# EAGLE design encoder_adapter (EAGLE 9.6.2)
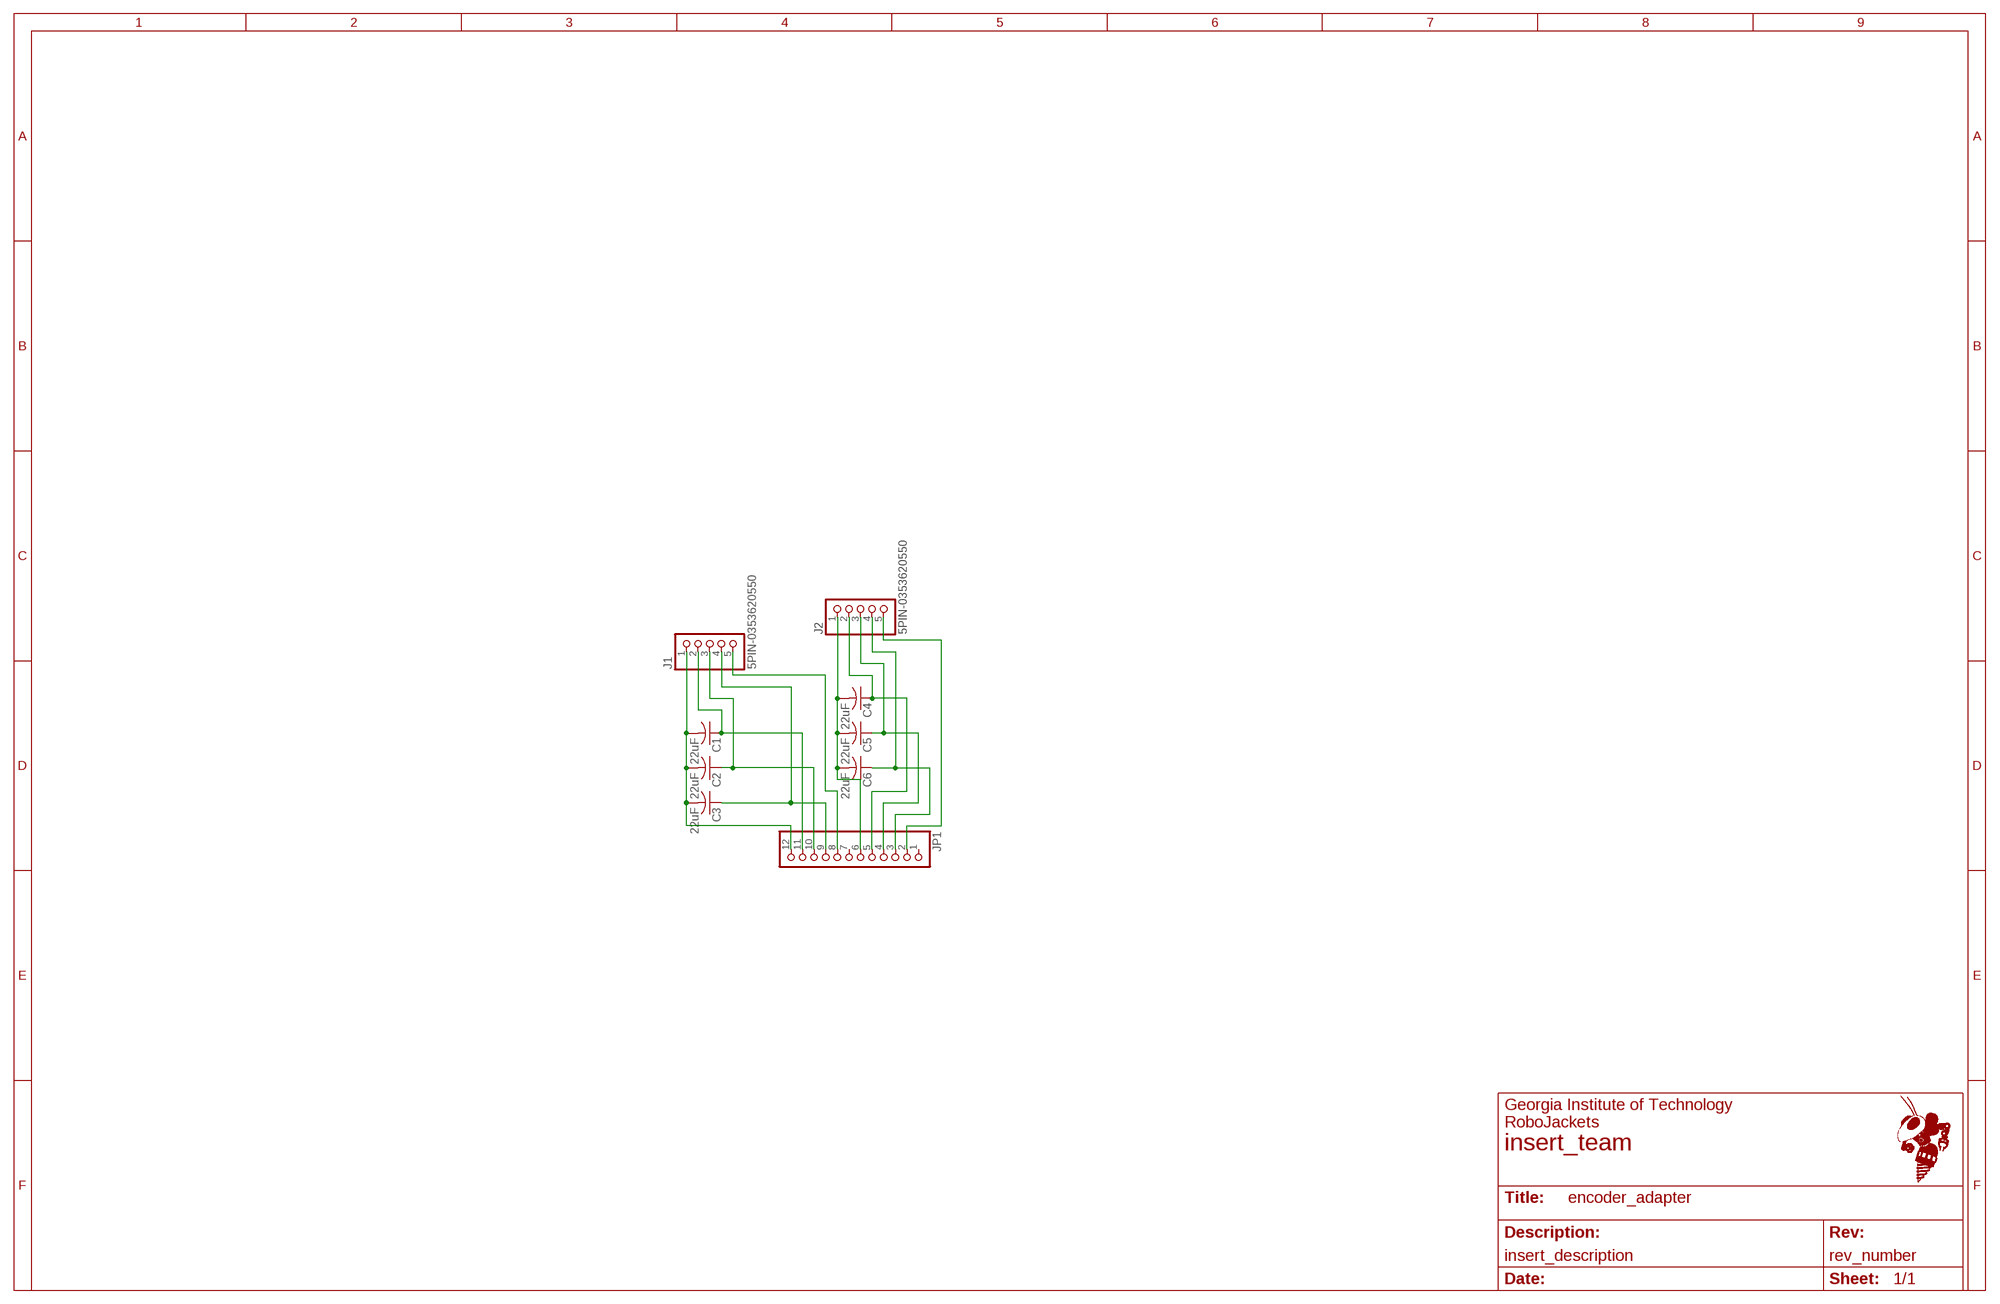
[diagram p0: schematic, sheet 1]
FRAME1 (FRAME_11_17): REVISION: rev_number; SCH_DESC: insert_description; TEAM: insert_team

## Parts
C1  22uF  C-USC0805  [C0805]
C2  22uF  C-USC0805  [C0805]
C3  22uF  C-USC0805  [C0805]
C4  22uF  C-USC0805  [C0805]
C5  22uF  C-USC0805  [C0805]
C6  22uF  C-USC0805  [C0805]
J1  5PIN-0353620550  [0353620550]
J2  5PIN-0353620550  [0353620550]
JP1  PINHD-1X12  [1X12]

## Nets
N$1: C1.2 C2.2 C3.2 J1.1 JP1.12
N$2: C3.1 J1.4 JP1.9
N$3: C1.1 J1.2 JP1.11
N$5: C2.1 J1.3 JP1.10
N$7: C4.1 J2.2 JP1.5
N$8: C5.1 J2.3 JP1.4
N$9: C6.1 J2.4 JP1.3
N$10: J2.5 JP1.2
N$11: J1.5 JP1.8
N$16: C4.2 C5.2 C6.2 J2.1 JP1.6
Unconnected: JP1.1 JP1.7

## Library data of the parts
C1-C6 = rcl:C-US: CAPACITOR, American symbol; SPICEPREFIX: C
J1 J2 = RoboJackets-Connectors:5PIN-03536?: Description: Connector Header Through Hole, 5 position 0.079" (2.00mm) Link H: Digi-Key <https://www.digikey.com/products/en?keywords=0353630560> Link V: Digi-Key <https://www.digikey.com/products/en?keywords=0353620550>; DKPN: WM18923-ND
JP1 = RoboJackets-Connectors:PINHD-1X12: PIN HEADER

## Board
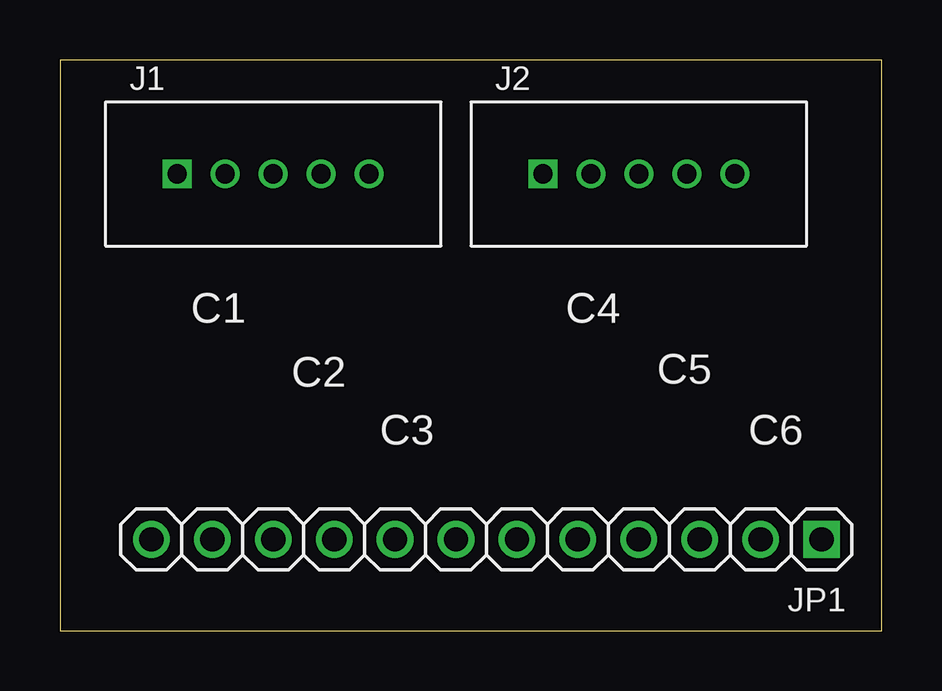
[diagram p1: board, top side]
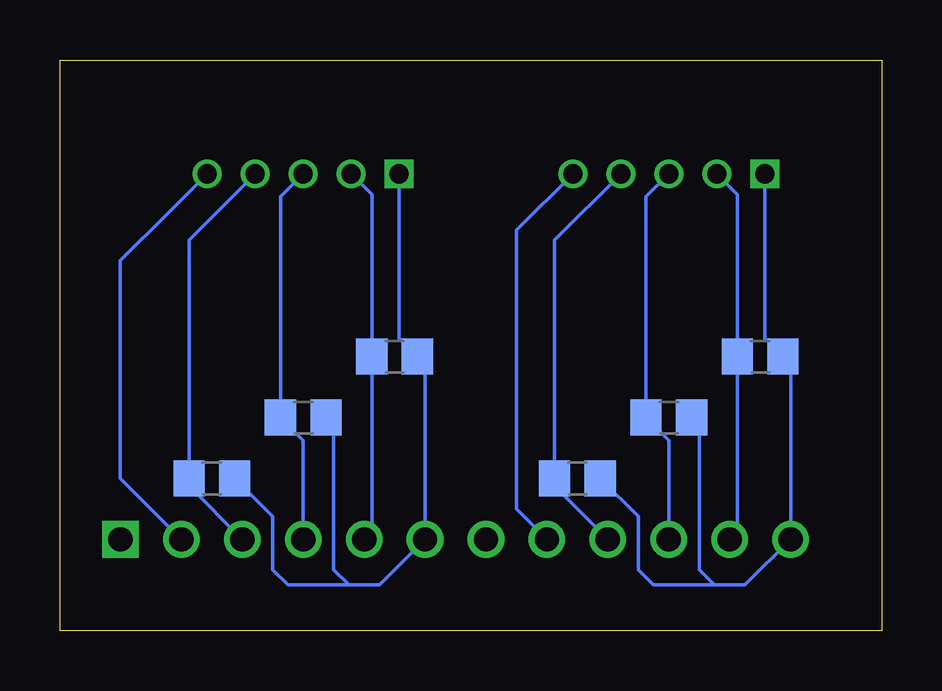
[diagram p2: board, bottom side, seen from below]

Size 34.27 x 23.8 mm. Coordinates in mm from the lower left corner, seen from the top.
Outline: 0,0 34.27,0 34.27,23.8 0,23.8 0,0
Copper layers 16: Bottom 0.035mm
Design rules "JLCPCB (1 Layer)": minimum track width 5mil, minimum drill 0.3mm, track to track 5mil, track to pad 5mil, pad to pad 5mil, via to via 20mil, smd to smd 5mil, copper to edge 0.2mm, drill to drill 21mil, minimum pad ring 6mil, minimum via ring 6mil, stop-mask expansion 2mil, vias tented up to drill 30mil, thermal gap 10mil

### Footprints (pad centres in the part's own frame; a part is rotated, then mirrored left to right if it is on the bottom)
C0805 = smd 1.3 x 1.5: 1 -0.95,0; 2 0.95,0
0353620550 = drill 0.8 square: 1 -4,0 | drill 0.8: 2 -2,0; 3 0,0; 4 2,0; 5 4,0
1X12 = drill 1.016 square: 1 -13.97,0 | drill 1.016: 2 -11.43,0; 3 -8.89,0; 4 -6.35,0; 5 -3.81,0; 6 -1.27,0; 7 1.27,0; 8 3.81,0; 9 6.35,0; 10 8.89,0; 11 11.43,0; 12 13.97,0

### Placement (x,y rotation side)
C1  5.08,11.43 0 bottom
C2  8.89,8.89 0 bottom
C3  12.7,6.35 0 bottom
C4  20.32,11.43 0 bottom
C5  24.13,8.89 0 bottom
C6  27.94,6.35 0 bottom
J1  8.89,19.05 0 top
J2  24.13,19.05 0 top
JP1  17.78,3.81 180 top

### Tracks (layer width: path | path; a pad name or v marks a point on that pad's centre or on a via)
N$1
  Bottom 0.152: J1.1 4.89,12.19 C1.2 3.81,11.11 JP1.12 5.71,1.91 6.98,1.91 | C3.2 10.16,4.76 10.16,2.54 9.53,1.91 6.98,1.91 | C2.2 7.62,8.57 7.62,2.54 6.98,1.91
N$2
  Bottom 0.152: JP1.9 13.65,6.03 C3.1 13.65,16.29 J1.4
N$3
  Bottom 0.152: J1.2 6.03,18.19 C1.1 6.03,4.13 JP1.11
N$5
  Bottom 0.152: 9.84,8.67 C2.1 | JP1.10 8.89,7.94 C2.1 | C2.1 9.84,18.1 J1.3
N$7
  Bottom 0.152: JP1.5 21.27,4.13 C4.1 21.27,18.19 J2.2
N$8
  Bottom 0.152: JP1.4 24.13,7.94 C5.1 25.08,18.1 J2.3
N$9
  Bottom 0.152: JP1.3 28.89,6.03 C6.1 28.89,16.29 J2.4
N$10
  Bottom 0.152: J2.5 29.31,17.88 29.74,17.44 31.75,15.43 31.75,6.35 JP1.2
N$11
  Bottom 0.152: JP1.8 15.24,5.08 15.24,16.7 J1.5
N$16
  Bottom 0.152: J2.1 20.13,12.19 C4.2 19.05,11.11 JP1.6 20.96,1.91 22.22,1.91 | C5.2 22.86,8.57 22.86,2.54 22.22,1.91 | C6.2 25.4,4.76 25.4,2.54 24.77,1.91 22.22,1.91